# Altium schematic sheet TI_ADC_CURRENT.SchDoc
size 999 x 999 mm
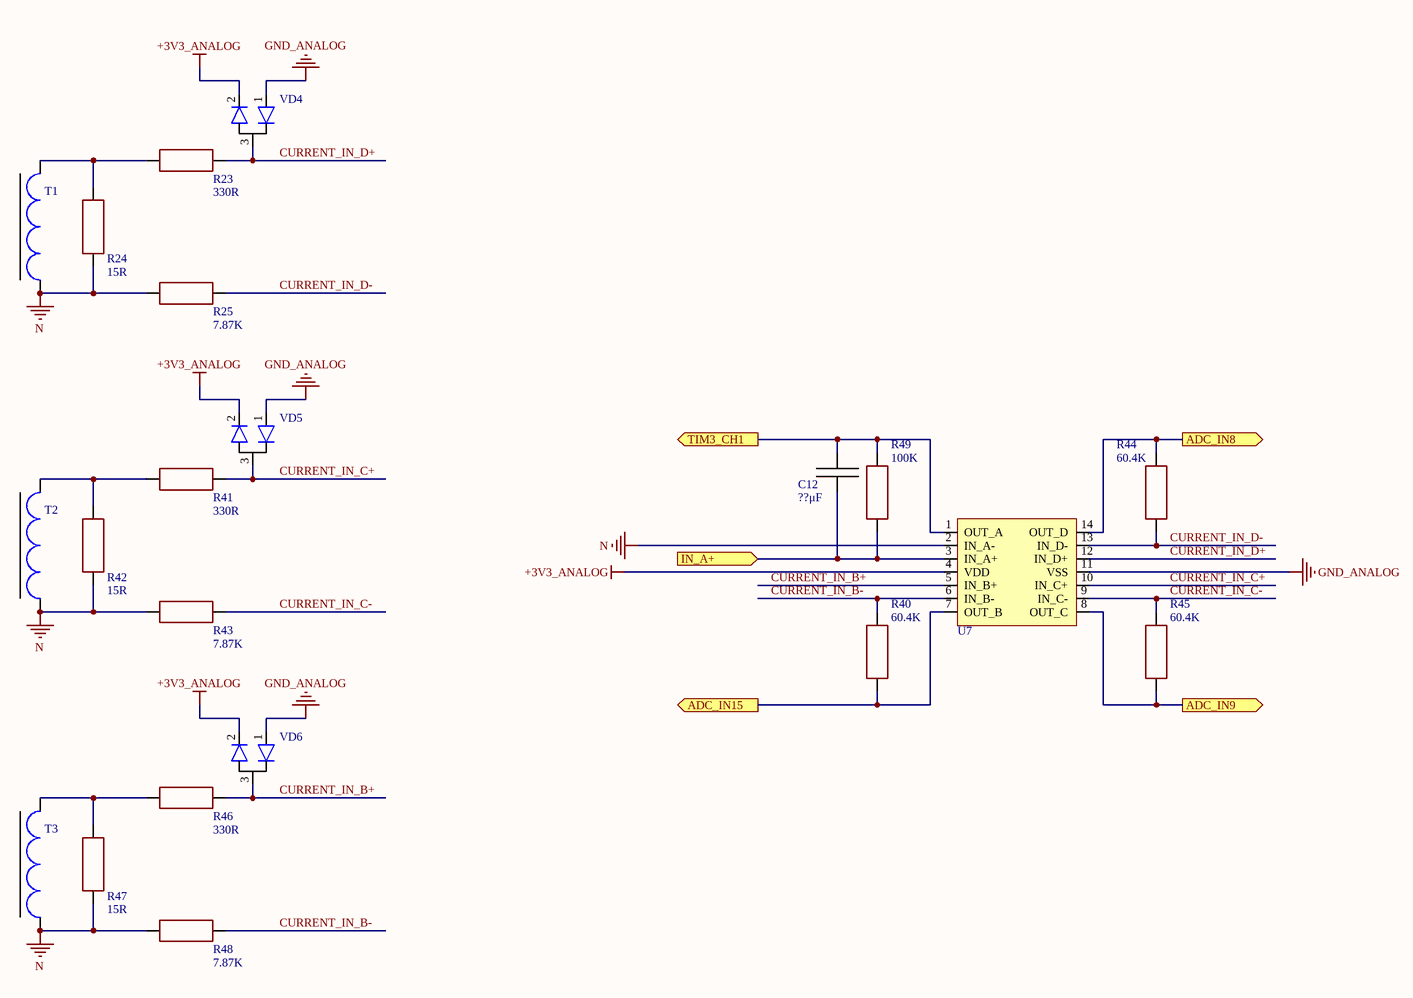
[diagram p0: TI_ADC_CURRENT.SchDoc]

## Parts
C12  value ??μF  [CAP: 0603]  (hidden comment: Cap_0603)
R23  value 330R  [RES: 0603]  (hidden comment: Resistor_0603)
R24  value 15R  [RES: 0603]  (hidden comment: Resistor_0603)
R25  value 7.87K  [RES: 0603]  (hidden comment: Resistor_0603)
R40  value 60.4K  [RES: 0603]  (hidden comment: Resistor_0603)
R41  value 330R  [RES: 0603]  (hidden comment: Resistor_0603)
R42  value 15R  [RES: 0603]  (hidden comment: Resistor_0603)
R43  value 7.87K  [RES: 0603]  (hidden comment: Resistor_0603)
R44  value 60.4K  [RES: 0603]  (hidden comment: Resistor_0603)
R45  value 60.4K  [RES: 0603]  (hidden comment: Resistor_0603)
R46  value 330R  [RES: 0603]  (hidden comment: Resistor_0603)
R47  value 15R  [RES: 0603]  (hidden comment: Resistor_0603)
R48  value 7.87K  [RES: 0603]  (hidden comment: Resistor_0603)
R49  value 100K  [RES: 0603]  (hidden comment: Resistor_0603)
T1  AC-1005  [AC-1005]  (value not drawn)
T2  AC-1005  [AC-1005]  (value not drawn)
T3  AC-1005  [AC-1005]  (value not drawn)
U7  MCP6004  [SOIC-14]  (value not drawn)
VD4  BAV99  [SOT-23-3]  (value not drawn)
VD5  BAV99  [SOT-23-3]  (value not drawn)
VD6  BAV99  [SOT-23-3]  (value not drawn)

## Ports
ADC_IN8 (out), ADC_IN9 (out), ADC_IN15 (out), IN_A+ (in), TIM3_CH1 (out)

## Nets
+3V3_ANALOG: U7.4(VDD) VD4.2 VD5.2 VD6.2
GND_ANALOG: U7.11(VSS) VD4.1 VD5.1 VD6.1
N: R24.1 R25.1 R42.1 R43.1 R47.1 R48.1 T1.1 T2.1 T3.1 U7.2(IN_A-)
ADC_IN8: R44.2 U7.14(OUT_D) ; port ADC_IN8
ADC_IN9: R45.1 U7.8(OUT_C) ; port ADC_IN9
ADC_IN15: R40.1 U7.7(OUT_B) ; port ADC_IN15
CURRENT_IN_B+: R46.2 U7.5(IN_B+) VD6.3
CURRENT_IN_B-: R40.2 R48.2 U7.6(IN_B-)
CURRENT_IN_C+: R41.2 U7.10(IN_C+) VD5.3
CURRENT_IN_C-: R43.2 R45.2 U7.9(IN_C-)
CURRENT_IN_D+: R23.2 U7.12(IN_D+) VD4.3
CURRENT_IN_D-: R25.2 R44.1 U7.13(IN_D-)
IN_A+: C12.2 R49.1 U7.3(IN_A+) ; port IN_A+
TIM3_CH1: C12.1 R49.2 U7.1(OUT_A) ; port TIM3_CH1
NetR23_1: R23.1 R24.2 T1.2
NetR41_1: R41.1 R42.2 T2.2
NetR46_1: R46.1 R47.2 T3.2

## Library data of the parts
C12 = Cap_0603: TypeDielectric: X7R(X5R); Voltage: ??V; Package/Case: 0603; Temperature: -55...+125°C(-55...+85°C); Product Category: Capacitors
R23-R25 R40-R49 = Resistor_0603: Power: 0.1W; Tolerance: ±5%; Package/Case: 0603; Temperature: -55...+125°C; Product Category: Resistors
T1-T3 = AC-1005: Current Transformer, primary current: 5A; Manufacturer: Talema; Analogue: CST-1005(https://eu.mouser.com/datasheet/2/410/CST_1005-1892657.pdf); Datasheet: https://static.chipdip.ru/lib/884/DOC003884697.pdf; HelpURL: https://www.chipdip.ru/product/ac-1005; Product Category: Current Transformers
U7 = MCP6004: 1 MHz, Low-Power Op Amp; Manufacturer: Microchip; Datasheet: https://eu.mouser.com/ProductDetail/Microchip-Technology-Atmel/MCP6004-I-SL?qs=n%2FfJlMG9rCZ2%2F%2FCryvZ52w%3D%3D; HelpURL: https://eu.mouser.com/ProductDetail/Microchip-Technology-Atmel/MCP6004-I-SL?qs=n%2FfJlMG9rCZ2%2F%2FCryvZ52w%3D%3D; Package/Case: SOIC-14; Product Category: Operational Amplifiers
VD4-VD6 = BAV99: High-speed switching diode; Manufacturer: Nexperia; Datasheet: https://eu.mouser.com/datasheet/2/916/BAV99_SER-1370693.pdf; HelpURL: https://eu.mouser.com/ProductDetail/Nexperia/BAV99235?qs=me8TqzrmIYWUP4h8SbZlfQ%3D%3D; Package/Case: SOT-23; Product Category: Diodes